# EAGLE design brain (EAGLE 9.6.2)
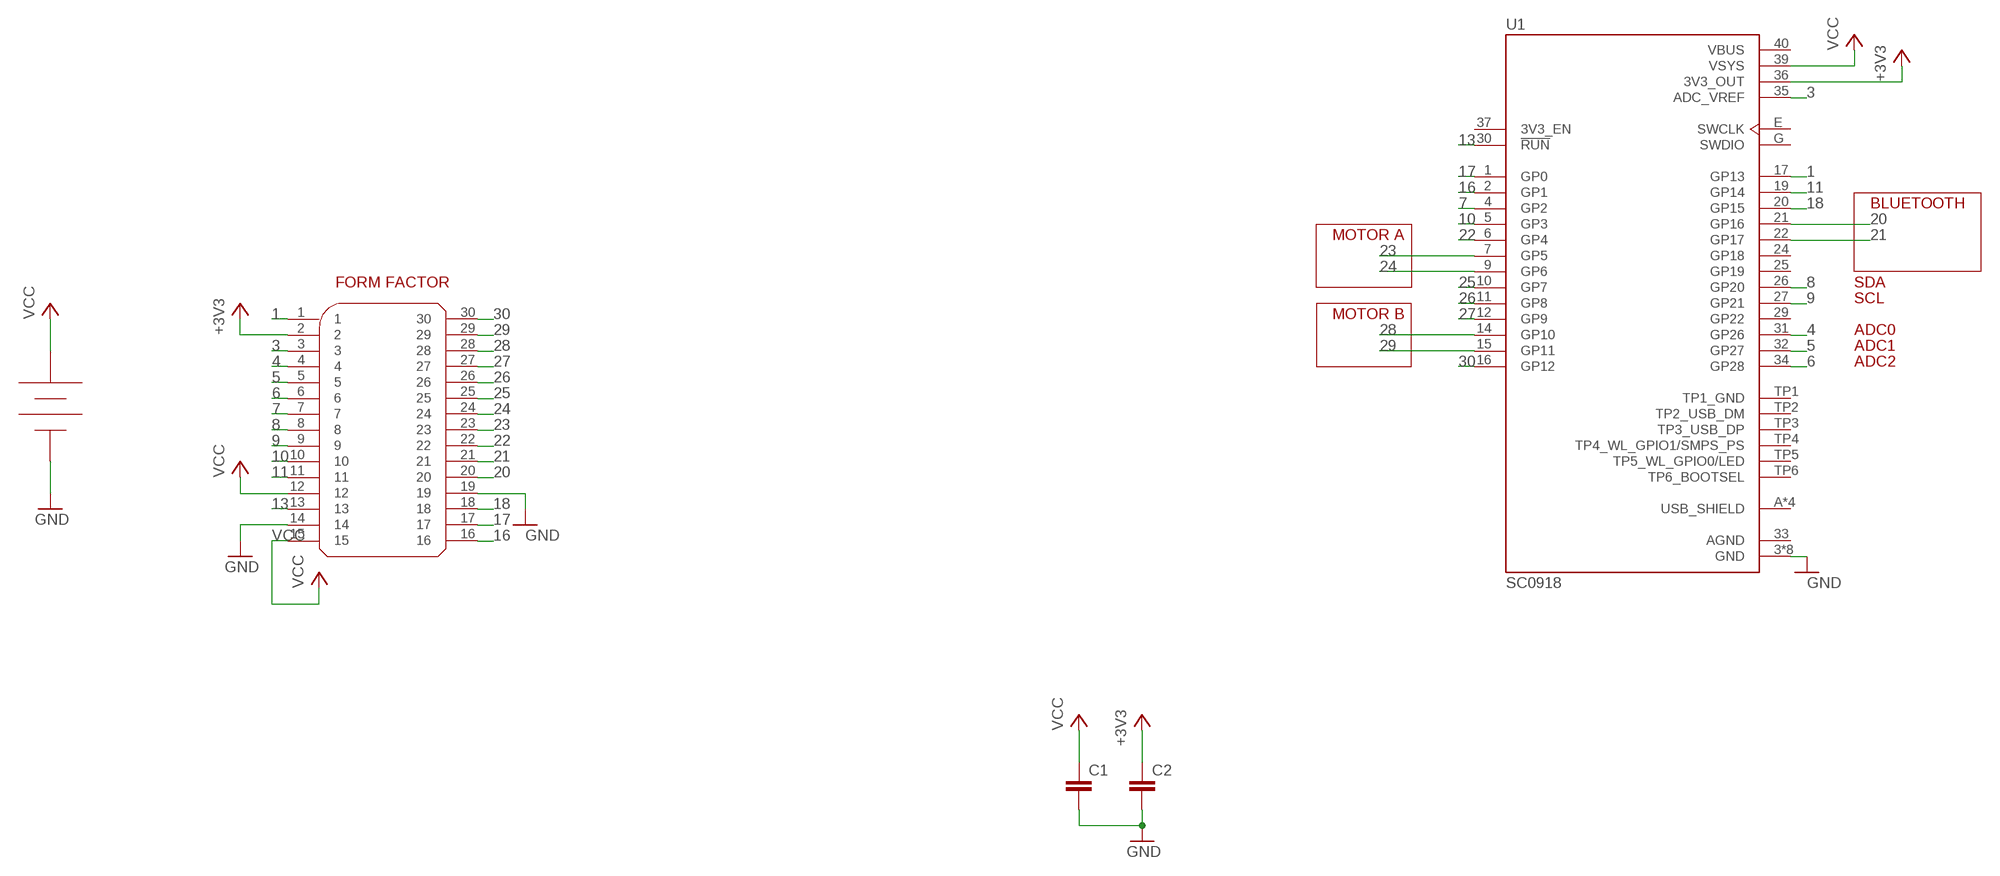
[diagram p0: schematic, sheet 1]

## Parts
C1  C-EU050-025X075  [C050-025X075]
C2  C-EU050-025X075  [C050-025X075]
U1  SC0918  [MODULE_SC0918]
U$4  RC_FORM_FACTOR  [RC_FORM_FACTOR]
U$6  LIPO_BATTERY  [JST_PH]

## Nets
1: U1.17(GP13) U$4.1
3: U1.35(ADC_VREF) U$4.3
4: U1.31(GP26) U$4.4
5: U1.32(GP27) U$4.5
6: U1.34(GP28) U$4.6
7: U1.4(GP2) U$4.7
8: U1.26(GP20) U$4.8
9: U1.27(GP21) U$4.9
10: U1.5(GP3) U$4.10
11: U1.19(GP14) U$4.11
13: U1.30(!RUN) U$4.13
16: U1.2(GP1) U$4.16
17: U1.1(GP0) U$4.17
18: U1.20(GP15) U$4.18
20: U1.21(GP16) U$4.20
21: U1.22(GP17) U$4.21
22: U1.6(GP4) U$4.22
23: U1.7(GP5) U$4.23
24: U1.9(GP6) U$4.24
25: U1.10(GP7) U$4.25
26: U1.11(GP8) U$4.26
27: U1.12(GP9) U$4.27
28: U1.14(GP10) U$4.28
29: U1.15(GP11) U$4.29
30: U1.16(GP12) U$4.30
+3V3: C2.1 U1.36(3V3_OUT) U$4.2
GND: C1.2 C2.2 U1.3(GND) U1.8(GND) U1.13(GND) U1.18(GND) U1.23(GND) U1.28(GND) U1.38(GND) U1.F(GND) U$4.14 U$4.19 U$6.GND(NEG)
VCC: C1.1 U1.39(VSYS) U$4.12 U$4.15 U$6.POS
Unconnected: U1.24(GP18) U1.25(GP19) U1.29(GP22) U1.37(3V3_EN) U1.E(SWCLK) U1.G(SWDIO) U1.TP2(TP2_USB_DM) U1.TP3(TP3_USB_DP) U1.TP4(TP4_WL_GPIO1/SMPS_PS) U1.TP5(TP5_WL_GPIO0/LED) U1.TP6(TP6_BOOTSEL)

## Notes on the sheet
- BLUETOOTH
- MOTOR A
- FORM FACTOR | SDA
- SCL
- MOTOR B
- ADC0
- ADC1
- ADC2

## Power pins joined to a net without a drawn wire
AGND: U1.33(AGND)
TP1_GND: U1.TP1(TP1_GND)
USB_SHIELD: U1.A(USB_SHIELD) U1.B(USB_SHIELD) U1.C(USB_SHIELD) U1.D(USB_SHIELD)
VBUS: U1.40(VBUS)

## Library data of the parts
C1 C2 = rcl:C-EU: CAPACITOR, European symbol; SPICEPREFIX: C
U1 = SC0918:SC0918; DESCRIPTION: - RP2040 Transceiver; 802.11 b/g/n (Wi-Fi, WiFi, WLAN), Bluetooth® 5 2.4GHz Evaluation Board; DIGIKEY_PART_NUMBER: 2648-SC0918TR-ND; MF: Raspberry Pi; MP: SC0918; PACKAGE: None; PURCHASE-URL: https://pricing.snapeda.com/search?q=SC0918&ref=eda
U$4 = rc_car:RC_FORM_FACTOR
U$6 = GIX:LIPO_BATTERY

## Board
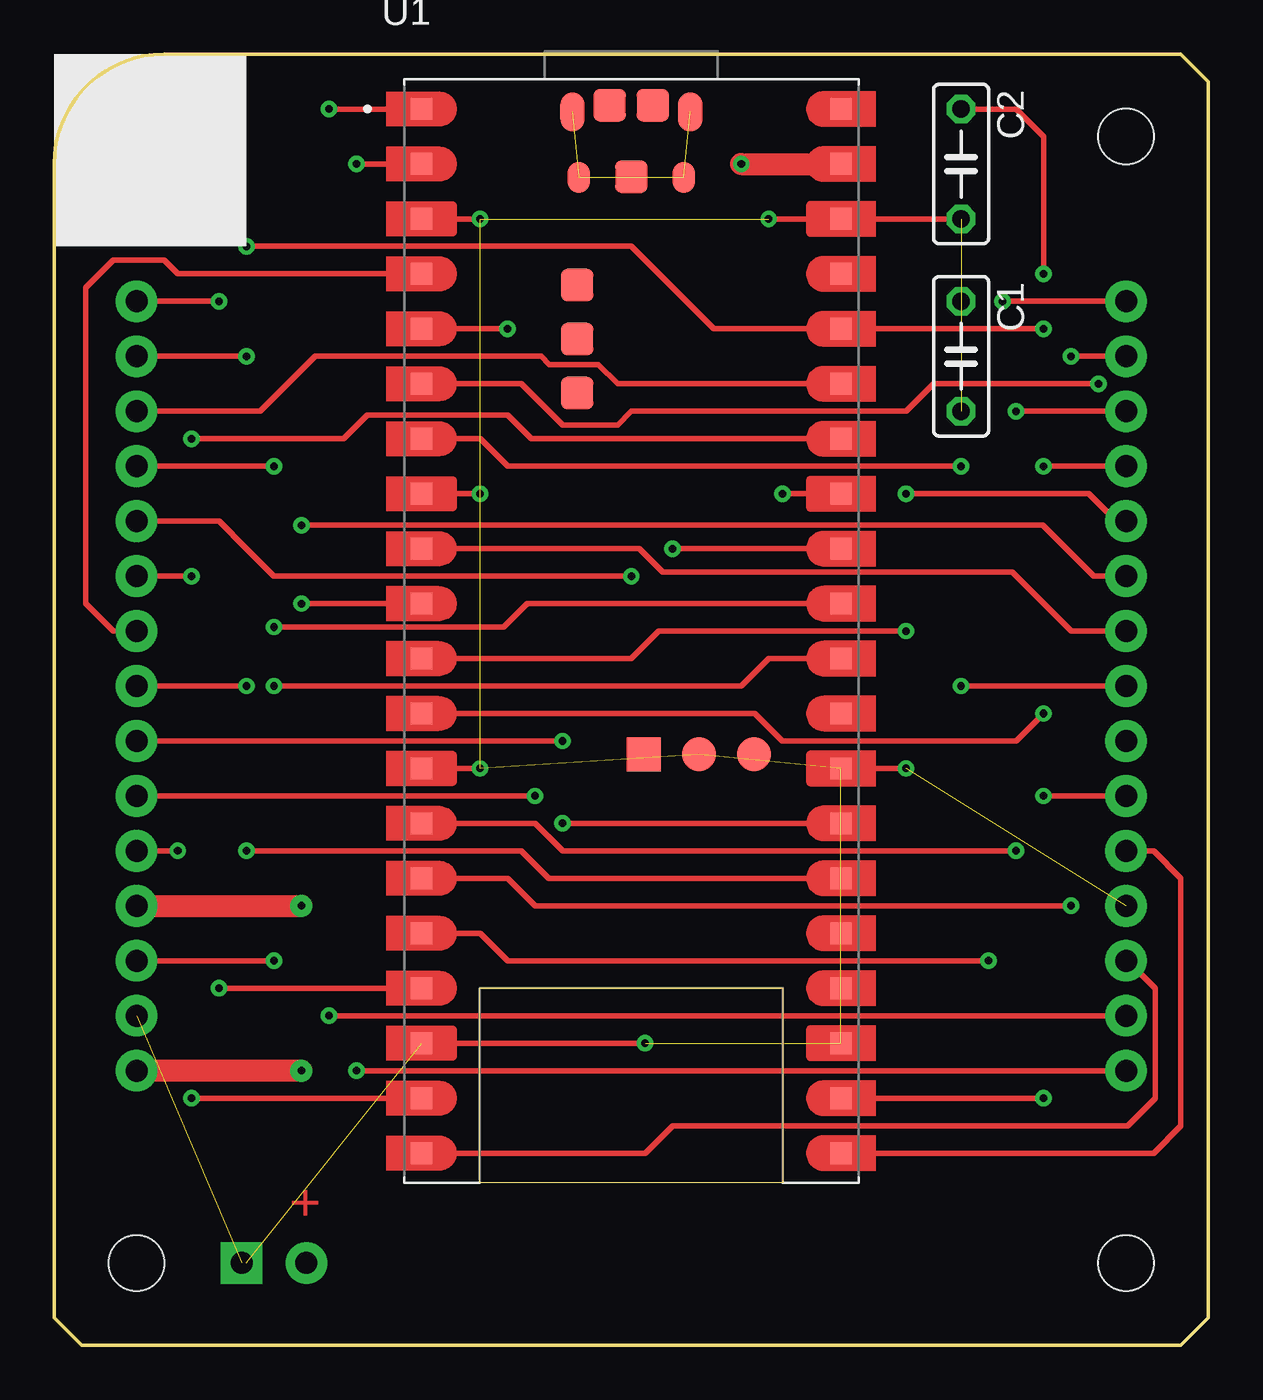
[diagram p1: board, top side]
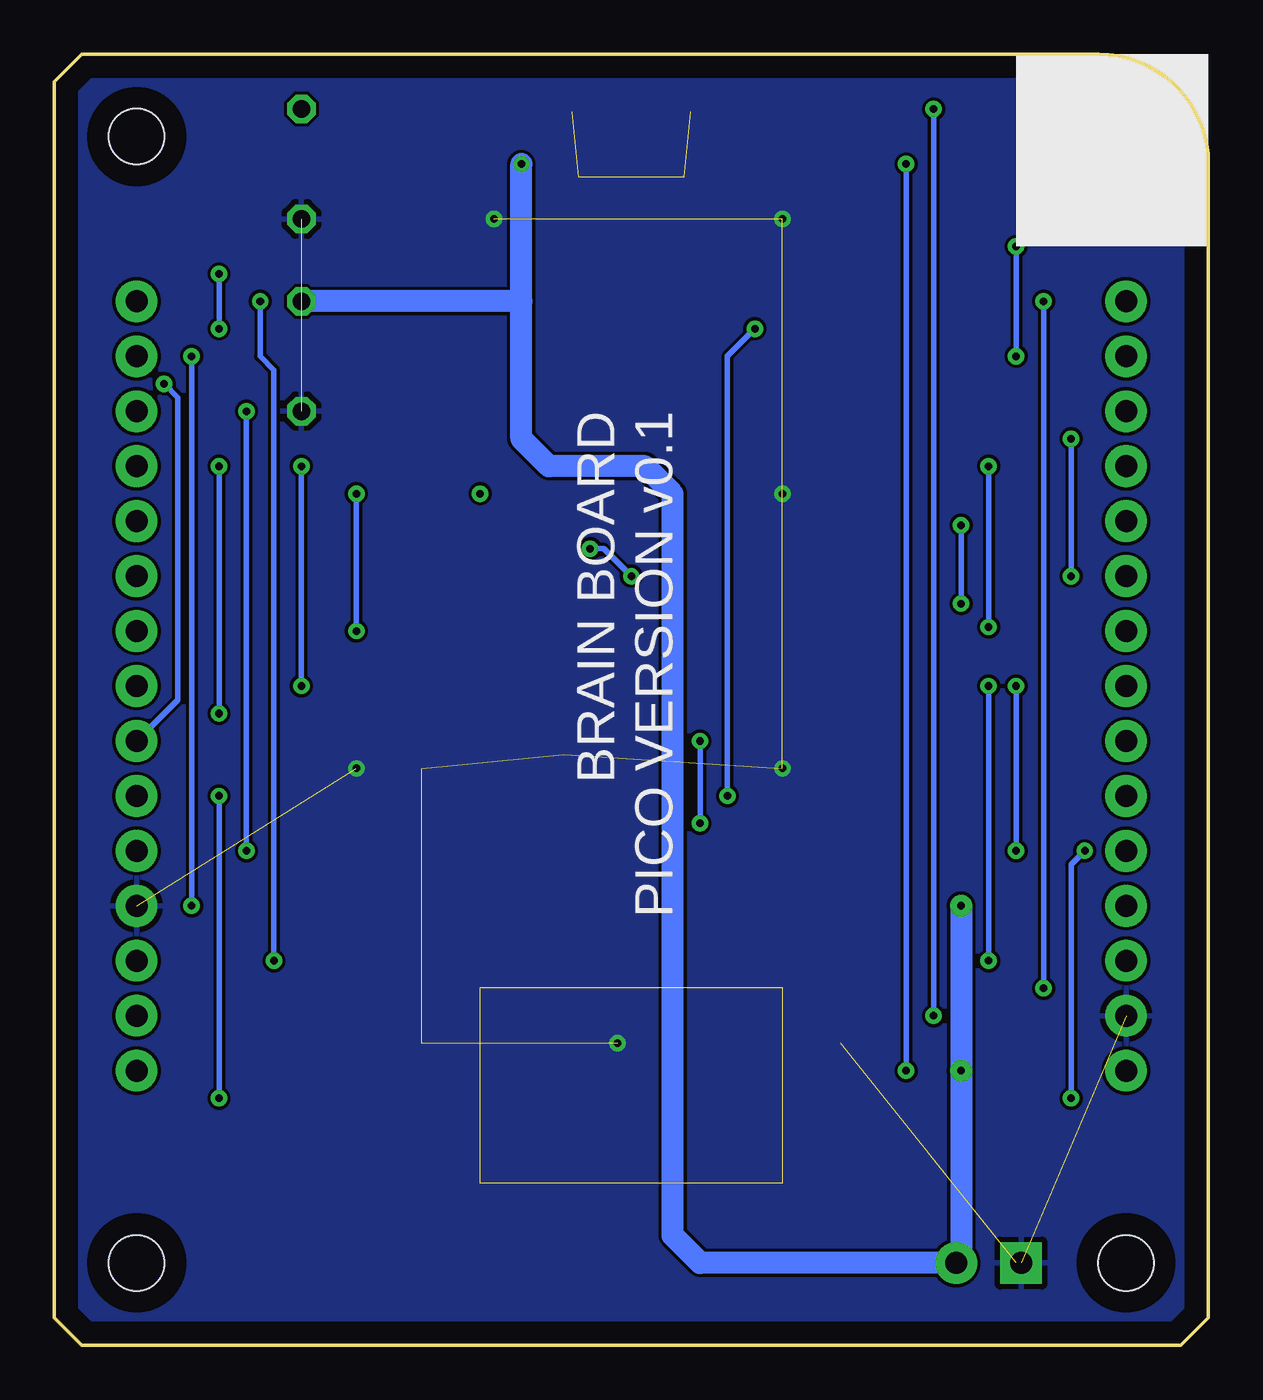
[diagram p2: board, bottom side, seen from below]

Size 53.34 x 59.69 mm. Coordinates in mm from the lower left corner, seen from the top.
Copper layers (1*16): Top 0.035mm / dielectric 1.5mm / Bottom 0.035mm
Design rules "default": minimum track width 6mil, minimum drill 0.35mm, track to track 6mil, track to pad 6mil, pad to pad 6mil, via to via 6mil, smd to smd 6mil, copper to edge 40mil, drill to drill 6mil, minimum pad ring 10mil, minimum via ring 8mil, stop-mask expansion 4mil, vias tented up to drill 0mil, thermal gap 10mil

### Footprints (pad centres in the part's own frame; a part is rotated, then mirrored left to right if it is on the bottom)
C050-025X075 = drill 0.813 octagon: 1 -2.54,0; 2 2.54,0
MODULE_SC0918 = smd 1 x 1: 1 -9.69,24.13; 2 -9.69,21.59; 3 -9.69,19.05; 4 -9.69,16.51; 5 -9.69,13.97; 6 -9.69,11.43; 7 -9.69,8.89; 8 -9.69,6.35; 9 -9.69,3.81; 10 -9.69,1.27; 11 -9.69,-1.27; 12 -9.69,-3.81; 13 -9.69,-6.35; 14 -9.69,-8.89; 15 -9.69,-11.43; 16 -9.69,-13.97; 17 -9.69,-16.51; 18 -9.69,-19.05; 19 -9.69,-21.59; 20 -9.69,-24.13; 21 9.69,-24.13; 22 9.69,-21.59; 23 9.69,-19.05; 24 9.69,-16.51; 25 9.69,-13.97; 26 9.69,-11.43; 27 9.69,-8.89; 28 9.69,-6.35; 29 9.69,-3.81; 30 9.69,-1.27; 31 9.69,1.27; 32 9.69,3.81; 33 9.69,6.35; 34 9.69,8.89; 35 9.69,11.43; 36 9.69,13.97; 37 9.69,16.51; 38 9.69,19.05; 39 9.69,21.59; 40 9.69,24.13 | smd 1.1 x 1.8: A -2.725,24; B 2.725,24 | smd 1.05 x 1.45: C -2.425,20.97; D 2.425,20.97 | smd 1.575 x 1.575: E 0.584,-5.7; F 3.124,-5.7; G 5.664,-5.7 | smd 1.5 x 1.5: TP1 0,21; TP2 1,24.3; TP3 -1,24.3; TP4 -2.5,16; TP5 -2.5,13.5; TP6 -2.5,11
RC_FORM_FACTOR = drill 1.016 pad 1.93: 1 3.81,48.26; 2 3.81,45.72; 3 3.81,43.18; 4 3.81,40.64; 5 3.81,38.1; 6 3.81,35.56; 7 3.81,33.02; 8 3.81,30.48; 9 3.81,27.94; 10 3.81,25.4; 11 3.81,22.86; 12 3.81,20.32; 13 3.81,17.78; 14 3.81,15.24; 15 3.81,12.7; 16 49.53,12.7; 17 49.53,15.24; 18 49.53,17.78; 19 49.53,20.32; 20 49.53,22.86; 21 49.53,25.4; 22 49.53,27.94; 23 49.53,30.48; 24 49.53,33.02; 25 49.53,35.56; 26 49.53,38.1; 27 49.53,40.64; 28 49.53,43.18; 29 49.53,45.72; 30 49.53,48.26 | hole 2.54: 3.81,55.88; 3.81,3.81; 49.53,3.81; 49.53,55.88
JST_PH = drill 1.016 pad 1.93 square: GND 0,-1.5 | drill 1.016 pad 1.93: POS 0,1.5

### Placement (x,y rotation side)
C1  41.91,45.72 270 top
C2  41.91,54.61 270 top
U1  26.67,33.02 0 top
U$4  0,0 0 top
U$6  10.16,3.81 270 top

### Tracks (layer width: path | path; a pad name or v marks a point on that pad's centre or on a via)
1  (via drill 0.35)
  Top 0.254: U$4.1 v7.62,48.26 | v7.62,16.51 U1.17
  Bottom 0.254: v7.62,48.26 v7.62,16.51
3
  Top 0.254: U$4.3 9.53,43.18 10.79,44.45 12.06,45.72 22.51,45.72 22.89,45.34 25.15,45.34 26.04,44.45 U1.35
4  (via drill 0.35)
  Top 0.254: v10.16,33.21 20.77,33.21 21.85,34.29 U1.31 | v10.16,40.64 U$4.4
  Bottom 0.254: v10.16,40.64 v10.16,33.21
5  (via drill 0.35)
  Top 0.254: U$4.5 7.62,38.1 8.89,36.83 10.16,35.56 v26.67,35.56 | v28.57,36.83 U1.32
  Bottom 0.254: v26.67,35.56 27.94,36.83 v28.57,36.83
6  (via drill 0.35)
  Top 0.254: U$4.6 v6.35,35.56 | v6.35,41.91 13.38,41.91 14.46,42.99 20.95,42.99 22.04,41.91 U1.34
  Bottom 0.254: v6.35,41.91 v6.35,35.56
7
  Top 0.254: U$4.7 2.74,33.02 1.47,34.29 1.47,48.9 2.74,50.16 5.08,50.16 5.71,49.53 U1.4
8  (via drill 0.35)
  Top 0.254: U$4.8 v8.89,30.48 | U1.26 22.86,21.59 21.59,22.86 v8.89,22.86
  Bottom 0.254: v8.89,30.48 v8.89,22.86
9  (via drill 0.35)
  Top 0.254: U$4.9 v23.5,27.94 | v23.5,24.13 U1.27
  Bottom 0.254: v23.5,27.94 v23.5,24.13
10  (via drill 0.35)
  Top 0.254: U$4.10 v22.23,25.4 | v20.95,46.99 U1.5
  Bottom 0.254: v20.95,46.99 22.23,45.72 v22.23,25.4
11  (via drill 0.35)
  Top 0.254: U$4.11 v5.71,22.86 | v6.35,11.43 U1.19
  Bottom 0.254: v5.71,22.86 6.35,22.23 v6.35,11.43
13  (via drill 0.35)
  Top 0.254: U$4.13 v10.16,17.78 | v10.16,30.48 31.75,30.48 33.02,31.75 U1.30
  Bottom 0.254: v10.16,30.48 v10.16,17.78
16  (via drill 0.35)
  Top 0.254: U$4.16 v13.97,12.7 | v13.97,54.61 U1.2
  Bottom 0.254: v13.97,54.61 v13.97,12.7
17  (via drill 0.35)
  Top 0.254: U$4.17 v12.7,15.24 | v12.7,57.15 U1.1
  Bottom 0.254: v12.7,15.24 v12.7,57.15
18
  Top 0.254: U$4.18 49.61,17.78 50.88,16.51 50.88,11.43 49.61,10.16 28.57,10.16 27.3,8.89 U1.20
20
  Top 0.254: U$4.20 50.8,22.86 52.07,21.59 52.07,10.16 50.8,8.89 U1.21
21  (via drill 0.35)
  Top 0.254: U$4.21 v45.72,25.4 | v45.72,11.43 U1.22
  Bottom 0.254: v45.72,25.4 v45.72,11.43
22  (via drill 0.35)
  Top 0.254: v48.26,44.45 40.64,44.45 39.37,43.18 26.67,43.18 26.04,42.55 23.5,42.55 22.23,43.81 21.59,44.45 U1.6
  Bottom 0.254: v48.26,44.45 47.62,43.81 47.62,29.84 U$4.22
23  (via drill 0.35)
  Top 0.254: U$4.23 v41.91,30.48 | v41.91,40.64 20.95,40.64 19.68,41.91 U1.7
  Bottom 0.254: v41.91,40.64 v41.91,30.48
24
  Top 0.254: U1.9 27.04,36.83 28.13,35.75 44.26,35.75 46.99,33.02 U$4.24
25  (via drill 0.35)
  Top 0.254: U$4.25 48.03,35.56 46.76,36.83 45.68,37.91 v11.43,37.91 | v11.43,34.29 U1.10
  Bottom 0.254: v11.43,37.91 v11.43,34.29
26  (via drill 0.35)
  Top 0.254: U$4.26 49.07,38.1 47.8,39.37 v39.37,39.37 | v39.37,33.02 27.94,33.02 26.67,31.75 U1.11
  Bottom 0.254: v39.37,39.37 v39.37,33.02
27  (via drill 0.35)
  Top 0.254: U$4.27 v45.72,40.64 | v45.72,29.21 44.45,27.94 33.66,27.94 32.38,29.21 U1.12
  Bottom 0.254: v45.72,40.64 v45.72,29.21
28  (via drill 0.35)
  Top 0.254: U$4.28 v44.45,43.18 | v44.45,22.86 23.5,22.86 22.23,24.13 U1.14
  Bottom 0.254: v44.45,43.18 v44.45,22.86
29  (via drill 0.35)
  Top 0.254: U$4.29 v46.99,45.72 | v46.99,20.32 22.23,20.32 20.95,21.59 U1.15
  Bottom 0.254: v46.99,45.72 v46.99,20.32
30  (via drill 0.35)
  Top 0.254: U$4.30 v43.81,48.26 | v43.18,17.78 20.95,17.78 19.68,19.05 U1.16
  Bottom 0.254: v43.81,48.26 43.81,45.72 43.18,45.09 v43.18,17.78
+3V3  (via drill 0.35)
  Top 0.254: v8.89,50.8 26.67,50.8 30.48,46.99 U1.36 v45.72,46.99 | v8.89,45.72 U$4.2 | v45.72,49.53 45.72,55.88 44.45,57.15 C2.1
  Bottom 0.254: v8.89,50.8 v8.89,45.72 | v45.72,49.53 v45.72,46.99
AGND  (via drill 0.35)
  Top 0.254: U1.33 v33.66,39.37
GND  (via drill 0.35)  (11 unrouted)
  Top 0.254: 8.89,3.81 U$6.GND | U1.28 v39.37,26.67 | U1.13 v19.68,26.67 | U1.8 v19.68,39.37 | v33.02,52.07 U1.38 C2.2 | U1.3 v19.68,52.07 | U1.18 v27.3,13.97
  pour Bottom: 53.34,0 0,0 0,54.61 arc-90 5.08,59.69 53.34,59.69
USB_SHIELD  (3 unrouted)
VCC  (via drill 0.35, 0.35 pad 1.02)
  Top 1.016: U$4.12 v11.43,20.32 | v31.75,54.61 U1.39 | v11.43,12.7 U$4.15
  Bottom 0.254: 11.43,3.81 U$6.POS
  Bottom 1.016: v11.43,20.32 v11.43,12.7 11.43,3.81 | U$6.POS 23.5,3.81 24.77,5.08 24.77,39.37 26.04,40.64 30.48,40.64 31.75,41.91 31.75,48.26 | 31.75,48.26 v31.75,54.61 | 31.75,48.26 C1.1

### Text on the board
bPlace: BRAIN BOARD / PICO VERSION v0.1